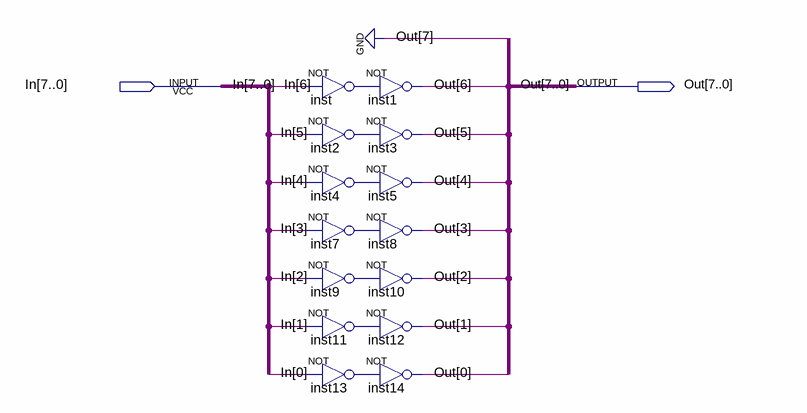
[diagram p0: schematic sheet]
// Quartus schematic ignoraprimeirobit.bdf as structural Verilog: 14 symbols, 2 pins
module ignoraprimeirobit (
  input  [7:0] In,
  output [7:0] Out
);

  wire inst2_out, inst4_out, inst7_out, inst9_out, inst11_out, inst13_out, inst_out;

  not inst (inst_out, In[6]);
  not inst2 (inst2_out, In[5]);
  not inst4 (inst4_out, In[4]);
  not inst7 (inst7_out, In[3]);
  not inst9 (inst9_out, In[2]);
  not inst11 (inst11_out, In[1]);
  not inst13 (inst13_out, In[0]);
  not inst1 (Out[6], inst_out);
  not inst3 (Out[5], inst2_out);
  not inst5 (Out[4], inst4_out);
  not inst8 (Out[3], inst7_out);
  not inst10 (Out[2], inst9_out);
  not inst12 (Out[1], inst11_out);
  not inst14 (Out[0], inst13_out);

  assign Out[7] = 1'b0;
endmodule
